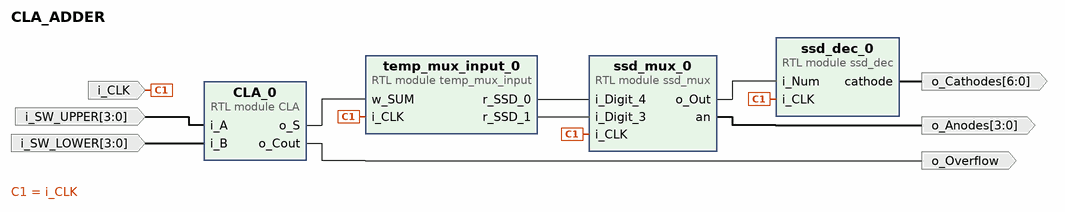
[diagram p0: block diagram of the top level]
# Vivado block design CLA_ADDER, xc7z007sclg400-1, Vivado 2018.2
create_bd_design CLA_ADDER

create_bd_port -dir I -from 3 -to 0 i_SW_UPPER
create_bd_port -dir I -from 3 -to 0 i_SW_LOWER
create_bd_port -dir I -type clk i_CLK
set_property -dict {CONFIG.FREQ_HZ 100000000} [get_bd_ports i_CLK]
create_bd_port -dir O o_Overflow
create_bd_port -dir O -from 6 -to 0 o_Cathodes
create_bd_port -dir O -from 3 -to 0 o_Anodes

create_bd_cell -type module -reference ssd_dec ssd_dec_0
create_bd_cell -type module -reference temp_mux_input temp_mux_input_0
create_bd_cell -type module -reference ssd_mux ssd_mux_0
create_bd_cell -type module -reference CLA CLA_0

# ---- connections ----

connect_bd_net -net i_A_0_1 [get_bd_ports i_SW_UPPER] [get_bd_pins CLA_0/i_A]
connect_bd_net -net i_B_0_1 [get_bd_ports i_SW_LOWER] [get_bd_pins CLA_0/i_B]
connect_bd_net -net clk_100MHz_1 [get_bd_ports i_CLK] [get_bd_pins ssd_dec_0/i_CLK] [get_bd_pins temp_mux_input_0/i_CLK] [get_bd_pins ssd_mux_0/i_CLK]
connect_bd_net [get_bd_pins CLA_0/o_S] [get_bd_pins temp_mux_input_0/w_SUM]
connect_bd_net [get_bd_pins temp_mux_input_0/r_SSD_0] [get_bd_pins ssd_mux_0/i_Digit_4]
connect_bd_net [get_bd_pins temp_mux_input_0/r_SSD_1] [get_bd_pins ssd_mux_0/i_Digit_3]
connect_bd_net [get_bd_pins ssd_mux_0/o_Out] [get_bd_pins ssd_dec_0/i_Num]
connect_bd_net [get_bd_pins CLA_0/o_Cout] [get_bd_ports o_Overflow]
connect_bd_net [get_bd_pins ssd_dec_0/cathode] [get_bd_ports o_Cathodes]
connect_bd_net [get_bd_pins ssd_mux_0/an] [get_bd_ports o_Anodes]

validate_bd_design
save_bd_design
